# Altium schematic sheet ws2812b.SchDoc
size Letter; SheetNumber: 6; SheetTotal: 8
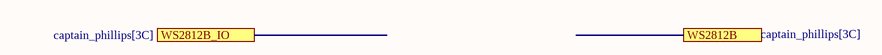
[diagram p0: ws2812b.SchDoc]

## Ports
WS2812B (see captain_phillips[3C]), WS2812B_IO (see captain_phillips[3C])